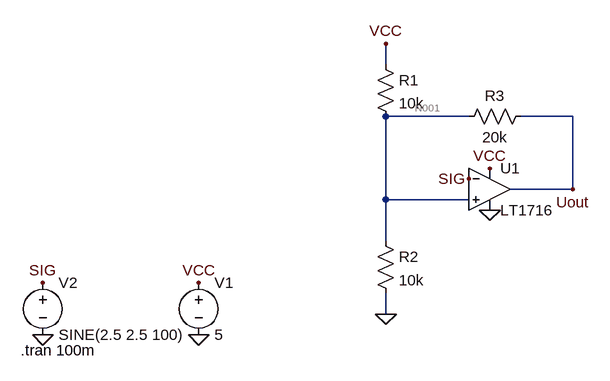
[diagram p0: schematic Draft1.asc]
Draft1.asc, the LTspice schematic file:
Version 4
SHEET 1 880 680
WIRE 400 -160 400 -192
WIRE 528 -80 400 -80
WIRE 688 -80 608 -80
WIRE 688 32 688 -80
WIRE 688 32 592 32
WIRE 400 48 400 -80
WIRE 528 48 400 48
WIRE 400 112 400 48
WIRE 400 224 400 192
FLAG 112 256 0
FLAG -128 256 0
FLAG -128 176 SIG
FLAG 112 176 VCC
FLAG 560 64 0
FLAG 400 224 0
FLAG 528 16 SIG
FLAG 560 0 VCC
FLAG 400 -192 VCC
FLAG 688 32 Uout
SYMBOL voltage 112 160 R0
WINDOW 123 0 0 Left 0
WINDOW 39 0 0 Left 0
SYMATTR InstName V1
SYMATTR Value 5
SYMBOL voltage -128 160 R0
WINDOW 123 0 0 Left 0
WINDOW 39 0 0 Left 0
SYMATTR InstName V2
SYMATTR Value SINE(2.5 2.5 100)
SYMBOL Comparators\\LT1716 560 32 R0
SYMATTR InstName U1
SYMBOL res 384 -176 R0
SYMATTR InstName R1
SYMATTR Value 10k
SYMBOL res 384 96 R0
SYMATTR InstName R2
SYMATTR Value 10k
SYMBOL res 624 -96 R90
WINDOW 0 0 56 VBottom 2
WINDOW 3 32 56 VTop 2
SYMATTR InstName R3
SYMATTR Value 20k
TEXT -162 280 Left 2 !.tran 100m

The netlist it stands for:
* Draft1.asc
V1 VCC 0 5
V2 SIG 0 SINE(2.5 2.5 100)
XU1 N001 SIG VCC 0 Uout LT1716  ; pins In+ In- V+ V- OUT
R1 VCC N001 10k
R2 N001 0 10k
R3 Uout N001 20k
.tran 100m
.lib LTC1.lib
.backanno
.end

* Results of the author's LTspice run, read from the files saved beside the schematic
* Operating Point, zero values left out:
*   V(vcc) = 5 V
*   V(sig) = 2.5 V
*   V(uout) = 71.65 mV
*   V(n001) = 2.014 V
*   I(R3) = -97.13 µA
*   I(R2) = 201.4 µA
*   I(R1) = 298.6 µA
*   I(V1) = -345.6 µA
*   Ix(u1:1) = -3.5 nA
*   Ix(u1:3) = 47.05 µA
*   Ix(u1:4) = -144.2 µA
*   Ix(u1:5) = 97.13 µA